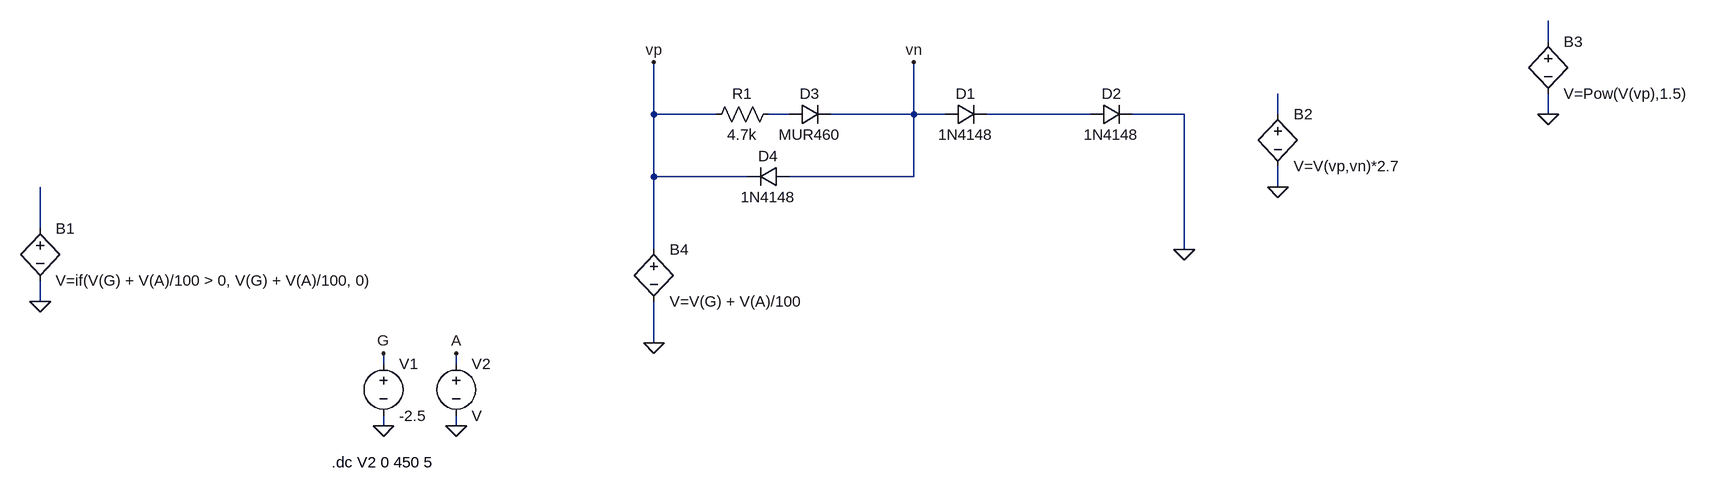
[diagram p0: schematic Curves.asc]
Curves.asc, the LTspice schematic file:
Version 4
SHEET 1 1408 680
WIRE 1168 -224 1168 -256
WIRE -208 -112 -208 -192
WIRE -112 -112 -208 -112
WIRE 0 -112 -32 -112
WIRE 192 -112 192 -192
WIRE 192 -112 64 -112
WIRE 240 -112 192 -112
WIRE 464 -112 304 -112
WIRE 608 -112 528 -112
WIRE 752 -112 752 -144
WIRE 1168 -112 1168 -144
WIRE -208 -16 -208 -112
WIRE -64 -16 -208 -16
WIRE 192 -16 192 -112
WIRE 192 -16 0 -16
WIRE 752 0 752 -32
WIRE -1152 64 -1152 0
WIRE -208 96 -208 -16
WIRE 608 96 608 -112
WIRE -1152 176 -1152 144
WIRE -208 240 -208 176
WIRE -624 272 -624 256
WIRE -512 272 -512 256
WIRE -624 368 -624 352
WIRE -512 368 -512 352
FLAG -1152 176 0
FLAG 608 96 0
FLAG -624 368 0
FLAG -512 368 0
FLAG -624 256 G
FLAG -512 256 A
FLAG -208 -192 vp
FLAG 192 -192 vn
FLAG 752 0 0
FLAG 1168 -112 0
FLAG -208 240 0
SYMBOL bv -1152 48 R0
SYMATTR InstName B1
SYMATTR Value V=if(V(G) + V(A)/100 > 0, V(G) + V(A)/100, 0)
SYMBOL voltage -624 256 R0
WINDOW 123 0 0 Left 0
WINDOW 39 0 0 Left 0
SYMATTR InstName V1
SYMATTR Value -2.5
SYMBOL voltage -512 256 R0
SYMATTR InstName V2
SYMBOL bv 752 -128 R0
SYMATTR InstName B2
SYMATTR Value V=V(vp,vn)*2.7
SYMBOL bv 1168 -240 R0
SYMATTR InstName B3
SYMATTR Value V=Pow(V(vp),1.5)
SYMBOL bv -208 80 R0
SYMATTR InstName B4
SYMATTR Value V=V(G) + V(A)/100
SYMBOL diode 0 -32 R90
WINDOW 0 0 32 VBottom 2
WINDOW 3 32 32 VTop 2
SYMATTR InstName D4
SYMATTR Value 1N4148
SYMBOL diode 464 -96 R270
WINDOW 0 32 32 VTop 2
WINDOW 3 0 32 VBottom 2
SYMATTR InstName D2
SYMATTR Value 1N4148
SYMBOL diode 240 -96 R270
WINDOW 0 32 32 VTop 2
WINDOW 3 0 32 VBottom 2
SYMATTR InstName D1
SYMATTR Value 1N4148
SYMBOL res -16 -128 R90
WINDOW 0 0 56 VBottom 2
WINDOW 3 32 56 VTop 2
SYMATTR InstName R1
SYMATTR Value 4.7k
SYMBOL diode 0 -96 R270
WINDOW 0 32 32 VTop 2
WINDOW 3 0 32 VBottom 2
SYMATTR InstName D3
SYMATTR Value MUR460
TEXT -704 424 Left 2 !.dc V2 0 450 5

The netlist it stands for:
* Curves.asc
B1 N005 0 V=if(V(G) + V(A)/100 > 0, V(G) + V(A)/100, 0)
V1 G 0 -2.5
V2 A 0 V
B2 N004 0 V=V(vp,vn)*2.7
B3 N001 0 V=Pow(V(vp),1.5)
B4 vp 0 V=V(G) + V(A)/100
D4 vn vp 1N4148
D2 N003 0 1N4148
D1 vn N003 1N4148
R1 N002 vp 4.7k
D3 N002 vn MUR460
.model D D
.lib standard.dio
.dc V2 0 450 5
.backanno
.end